# Altium schematic sheet InfraredModule.SchDoc
size A4
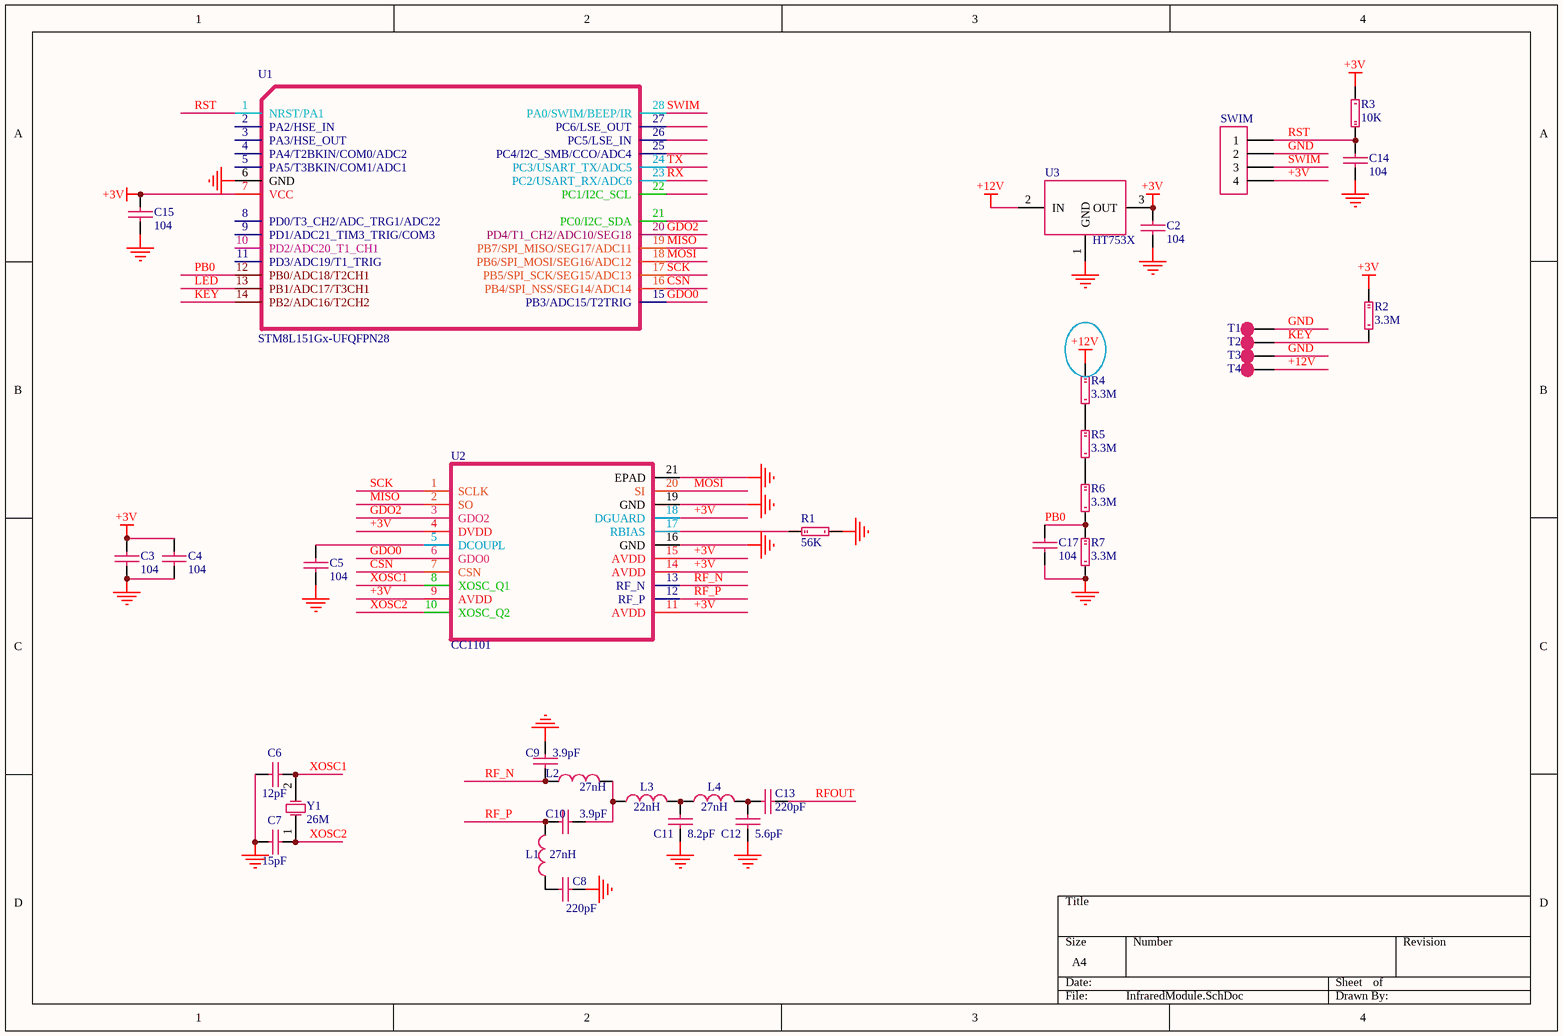
[diagram p0: InfraredModule.SchDoc]

## Parts
C2  104  [C0402]
C3  104  [C0402]
C4  104  [C0402]
C5  104  [C0402]
C6  12pF  [C0402]
C7  15pF  [C0402]
C8  220pF  [C0402]
C9  3.9pF  [C0402]
C10  3.9pF  [C0402]
C11  8.2pF  [C0402]
C12  5.6pF  [C0402]
C13  220pF  [C0402]
C14  104  [C0402]
C15  104  [C0402]
C17  104  [C0402]
L1  27nH  [L0402]
L2  27nH  [L0402]
L3  22nH  [L0402]
L4  27nH  [L0402]
R1  56K  [R0402]
R2  3.3M  [R0402]
R3  10K  [R0402]
R4  3.3M  [R0402]
R5  3.3M  [R0402]
R6  3.3M  [R0402]
R7  3.3M  [R0402]
SWIM  (no value)  [SIP4-2MM]
T1  (no value)  [TP]
T2  (no value)  [TP]
T3  (no value)  [TP]
T4  (no value)  [TP]
U1  STM8L151Gx-UFQFPN28  [QFN28-4X4]
U2  CC1101  [QLP-20]
U3  HT753X  [SOT-89]
Y1  26M  [XTAL-(3.2X2.5MM)-4P]

## Nets
+3V: C2.1 C3.1 C4.1 C15.1 R2.2 R3.1 SWIM.4 U1.7(VCC) U2.4(DVDD) U2.9(AVDD) U2.11(AVDD) U2.14(AVDD) U2.15(AVDD) U2.18(DGUARD) U3.3(OUT)
+12V: R4.2 T4.1 U3.2(IN)
GND: C2.2 C3.2 C4.2 C5.1 C6.2 C7.2 C8.2 C9.1 C11.2 C12.2 C14.2 C15.2 C17.2 R1.1 R7.1 SWIM.2 T1.1 T3.1 U1.6(GND) U2.16(GND) U2.19(GND) U2.21(EPAD) U3.1(GND)
CSN: U1.16(PB4/SPI_NSS/SEG14/ADC14) U2.7(CSN)
GDO0: U1.15(PB3/ADC15/T2TRIG) U2.6(GDO0)
GDO2: U1.20(PD4/T1_CH2/ADC10/SEG18) U2.3(GDO2)
KEY: R2.1 T2.1 U1.14(PB2/ADC16/T2CH2)
LED: U1.13(PB1/ADC17/T3CH1)
MISO: U1.19(PB7/SPI_MISO/SEG17/ADC11) U2.2(SO)
MOSI: U1.18(PB6/SPI_MOSI/SEG16/ADC12) U2.20(SI)
PB0: C17.1 R6.1 R7.2 U1.12(PB0/ADC18/T2CH1)
RF_N: C9.2 L2.1 U2.13(RF_N)
RF_P: C10.2 L1.2 U2.12(RF_P)
RFOUT: C13.2
RST: C14.1 R3.2 SWIM.1 U1.1(NRST/PA1)
RX: U1.23(PC2/USART_RX/ADC6)
SCK: U1.17(PB5/SPI_SCK/SEG15/ADC13) U2.1(SCLK)
SWIM: SWIM.3 U1.28(PA0/SWIM/BEEP/IR)
TX: U1.24(PC3/USART_TX/ADC5)
XOSC1: C6.1 U2.8(XOSC_Q1) Y1.2(OSC2)
XOSC2: C7.1 U2.10(XOSC_Q2) Y1.1(OSC1)
NetC5_2: C5.2 U2.5(DCOUPL)
NetC8_1: C8.1 L1.1
NetC10_1: C10.1 L2.2 L3.1
NetC11_1: C11.1 L3.2 L4.1
NetC12_1: C12.1 C13.1 L4.2
NetR1_2: R1.2 U2.17(RBIAS)
NetR4_1: R4.1 R5.2
NetR5_1: R5.1 R6.2

Not connected (* = marked no-connect by the designer): U1 2(PA2/HSE_IN) 3(PA3/HSE_OUT) 4(PA4/T2BKIN/COM0/ADC2) 5(PA5/T3BKIN/COM1/ADC1) 8(PD0/T3_CH2/ADC_TRG1/ADC22) 9(PD1/ADC21_TIM3_TRIG/COM3) 10(PD2/ADC20_T1_CH1) 11(PD3/ADC19/T1_TRIG) 21(PC0/I2C_SDA) 22(PC1/I2C_SCL) 25(PC4/I2C_SMB/CCO/ADC4) 26(PC5/LSE_IN) 27(PC6/LSE_OUT)

## Library data of the parts
C2-C15 C17 = CAP: 无极性电容
L1-L4 = INDUCTOR: 电感
R1-R7 = RES2: 贴片电阻
SWIM = HEADER 4X1
T1-T4 = TP: 测试点/触摸点
U1 = STM8L151Gx-UFQFPN28: STM8L单片机28引脚,封装UFQFPN28
U2 = CC1101: RF芯片 TI CC系列
U3 = HT753X: 合泰稳压芯片HT系列
Y1 = XTAL: 晶振